# Altium project DS130-1.02 G-M传感器.PrjPcb
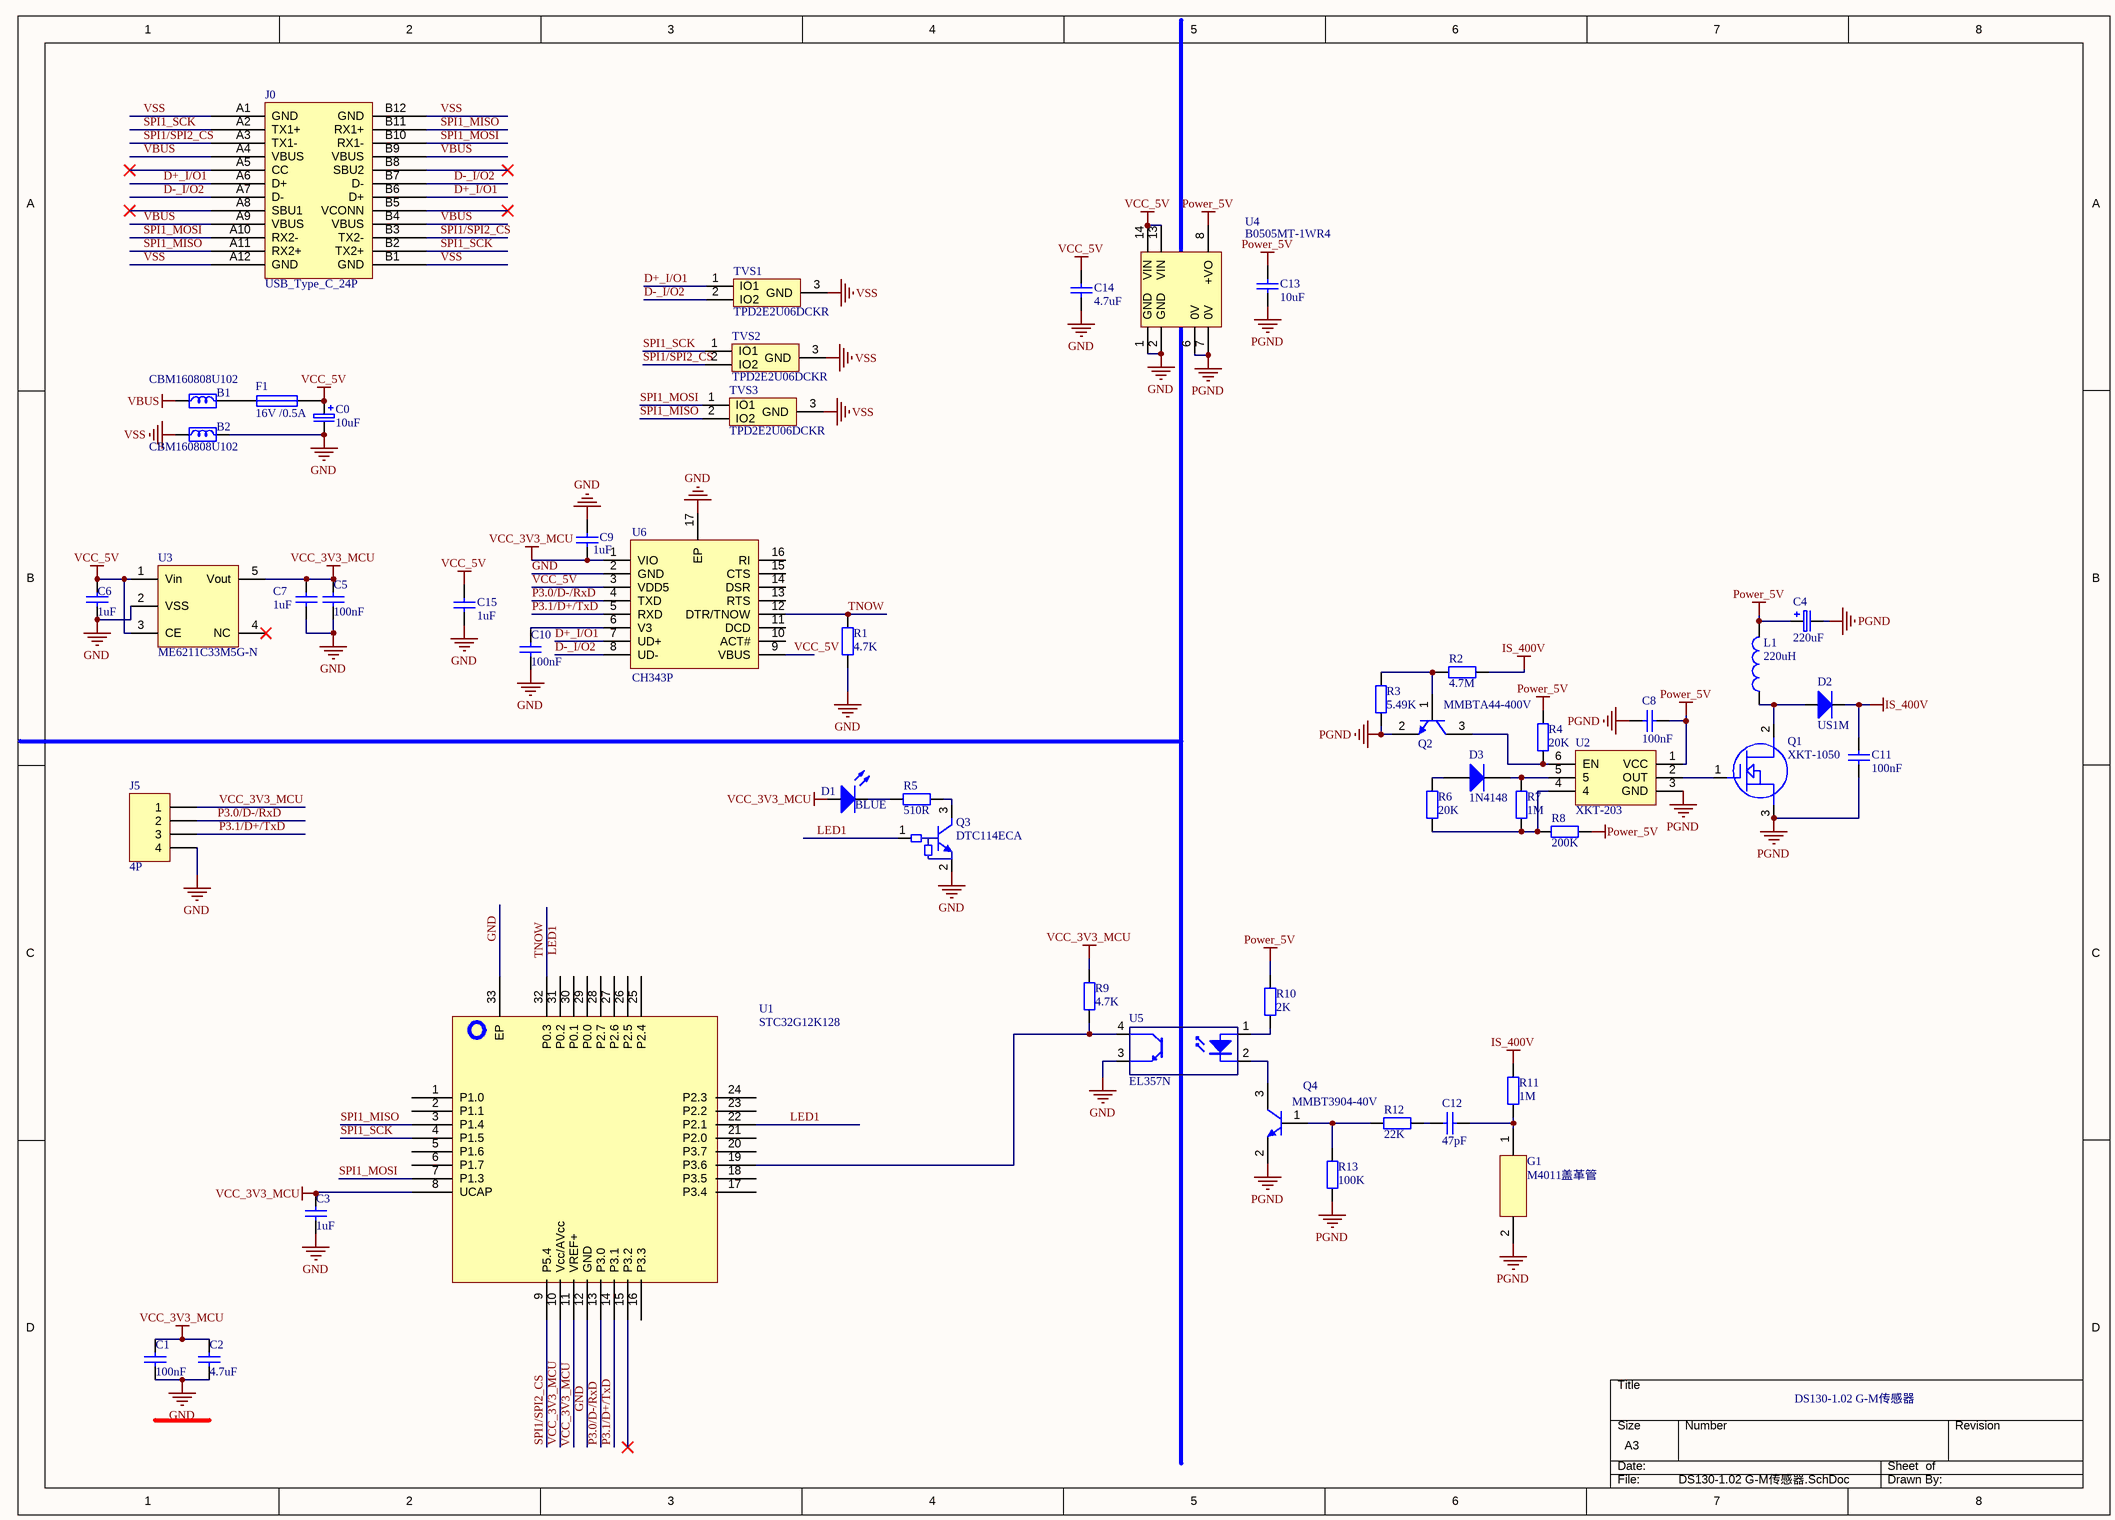
[diagram p0: DS130-1.02 G-M传感器.SchDoc]
1 sheet, 52 parts. Net scope: global (net labels, ports and power ports of the same name join across sheets).
Board file: DS130-1.02 G-M传感器.PcbDoc

## Sheet DS130-1.02 G-M传感器.SchDoc
size A3; SheetNumber: 1; SheetTotal: 1

### Parts
B1  CBM160808U102  [0603Bead]
B2  CBM160808U102  [0603Bead]
C0  value 10uF  [AVX_3216-18(1206)_SMD]  (hidden comment: AVX_10uF/16V ±10％(C106))
C1  value 100nF  [0603CAP]  (hidden comment: SMDCAP00013)
C2  value 4.7uF  [0603CAP]  (hidden comment: SMDCAP00012)
C3  value 1uF  [0603CAP]  (hidden comment: SMDCAP00015)
C4  value 220uF  [AVX_7343-31(2917)_SMD]  (hidden comment: AVX_220uF/16V ±10％(C227))
C5  value 100nF  [0603CAP]  (hidden comment: SMDCAP00013)
C6  value 1uF  [0603CAP]  (hidden comment: SMDCAP00015)
C7  value 1uF  [0603CAP]  (hidden comment: SMDCAP00015)
C8  value 100nF  [0603CAP]  (hidden comment: SMDCAP00013)
C9  value 1uF  [0603CAP]  (hidden comment: SMDCAP00015)
C10  value 100nF  [0603CAP]  (hidden comment: SMDCAP00013)
C11  value 100nF  [DIP_CL_10.16mm]  (hidden comment: DIPCAP03003)
C12  value 47pF  [1206CAP]  (hidden comment: MLCC 47pF 1kV ±5％ 1206)
C13  value 10uF  [0603CAP]  (hidden comment: SMDCAP00016)
C14  value 4.7uF  [0603CAP]  (hidden comment: SMDCAP00012)
C15  value 1uF  [0603CAP]  (hidden comment: SMDCAP00015)
D1  value BLUE  [LED_0805]  (hidden comment: SMDLED00010)
D2  value US1M  [SMA/DO-214AC]  (hidden comment: US1M-DO-214AC)
D3  value 1N4148  [SOD-123]  (hidden comment: DIPDIODE02001)
F1  value 16V /0.5A  [1206FUSE]  (hidden comment: SMD1206-050C-16V)
G1  M4011盖革管  [M4011-90]
J0  USB_Type_C_24P  [USB_TYPE_C_24P_Receptacle]
J5  value 4P  [H4]  (hidden comment: DIP4单排直针  间距2mm 针长11mm 铜)
L1  value 220uH  [IND-SMD_L8.0-W8.0]  (hidden comment: SMD_220uH 8.0*8.0)
Q1  XKT-1050  [TO-252]
Q2  value MMBTA44-400V  [SOT23]  (hidden comment: MMBTA44)
Q3  value DTC114ECA  [SOT23]  (hidden comment: SMDIC000037)
Q4  value MMBT3904-40V  [SOT23]  (hidden comment: MMBT3904)
R1  value 4.7K  [0603RES]  (hidden comment: Chip 4.7K 1/16W ±1％ 0603)
R2  value 4.7M  [1206RES]  (hidden comment: Chip 4.7M 1/4W ±1％ 1206 500V)
R3  value 5.49K  [0603RES]  (hidden comment: Chip 5.49K 1/10W ±1％ 0603)
R4  value 20K  [0603RES]  (hidden comment: SMDRES00058)
R5  value 510R  [0603RES]  (hidden comment: SMDRES00030)
R6  value 20K  [0603RES]  (hidden comment: SMDRES00058)
R7  value 1M  [0603RES]  (hidden comment: SMDRES00085)
R8  value 200K  [0603RES]  (hidden comment: SMDRES00075)
R9  value 4.7K  [0603RES]  (hidden comment: Chip 4.7K 1/16W ±1％ 0603)
R10  value 2K  [0603RES]  (hidden comment: SMDRES00042)
R11  value 1M  [0805RES]  (hidden comment: Chip 1M 1/10W ±1％ 0805 400V)
R12  value 22K  [0603RES]  (hidden comment: SMDRES00108)
R13  value 100K  [0603RES]  (hidden comment: SMDRES00071)
TVS1  TPD2E2U06DCKR  [SC-70-3_L2.0-W1.3-P0.65-LS2.1-BL]
TVS2  TPD2E2U06DCKR  [SC-70-3_L2.0-W1.3-P0.65-LS2.1-BL]
TVS3  TPD2E2U06DCKR  [SC-70-3_L2.0-W1.3-P0.65-LS2.1-BL]
U1  value STC32G12K128  [QFN-32-L4.0-W4.0]  (hidden comment: STC32G12K128_35I QFN32)
U2  XKT-203  [SOT23-6]
U3  ME6211C33M5G-N  [SOT23-5]
U4  B0505MT-1WR4  [DFN-14_7P_L9.0-W7.0-P1.27-BL_B0505MT-1WR4]
U5  EL357N  [SO-4]
U6  CH343P  [QFN-16_L3_W3]

### Nets
GND: B2.2 C0.2 C1.1 C2.1 C3.1 C5.1 C6.1 C7.1 C9.2 C10.1 C14.1 C15.1 J5.4 Q3.2(GND) R1.1 U1.12(GND) U1.33(EP) U3.2(VSS) U4.1(GND) U4.2(GND) U5.3(E) U6.2(GND) U6.17(EP)
IS_400V: C11.1 D2.2(K) R2.2 R11.2
PGND: C4.2 C8.1 C11.2 C13.1 G1.2 Q1.3(S) Q2.2(E) Q4.2(E) R3.1 R13.1 U2.3(GND) U4.6(0V) U4.7(0V)
Power_5V: C4.1 C8.2 C13.2 L1.2 R4.2 R8.1 R10.1 U2.1(VCC) U4.8(+VO)
VBUS: B1.1 J0.A4(VBUS) J0.A9(VBUS) J0.B4(VBUS) J0.B9(VBUS)
VCC_3V3_MCU: C1.2 C2.2 C3.2 C5.2 C7.2 C9.1 D1.1(A) J5.1 R9.2 U1.8(UCAP) U1.10(Vcc/AVcc) U1.11(VREF+) U3.5(Vout) U6.1(VIO)
VCC_5V: C0.1 C6.2 C14.2 C15.2 F1.2 U3.1(Vin) U3.3(CE) U4.13(VIN) U4.14(VIN) U6.3(VDD5) U6.9(VBUS)
VSS: B2.1 J0.A1(GND) J0.A12(GND) J0.B1(GND) J0.B12(GND) TVS1.3(GND) TVS2.3(GND) TVS3.3(GND)
D+_I/O1: J0.A6(D+) J0.B6(D+) TVS1.1(IO1) U6.7(UD+)
D-_I/O2: J0.A7(D-) J0.B7(D-) TVS1.2(IO2) U6.8(UD-)
LED1: Q3.1(IN) U1.22(P2.1)
P3.0/D-/RxD: J5.2 U1.13(P3.0) U6.4(TXD)
P3.1/D+/TxD: J5.3 U1.14(P3.1) U6.5(RXD)
SPI1/SPI2_CS: J0.A3(TX1-) J0.B3(TX2-) TVS2.2(IO2) U1.9(P5.4)
SPI1_MISO: J0.A11(RX2+) J0.B11(RX1+) TVS3.2(IO2) U1.3(P1.4)
SPI1_MOSI: J0.A10(RX2-) J0.B10(RX1-) TVS3.1(IO1) U1.7(P1.3)
SPI1_SCK: J0.A2(TX1+) J0.B2(TX2+) TVS2.1(IO1) U1.4(P1.5)
TNOW: R1.2 U1.32(P0.3) U6.12(DTR/TNOW)
NetB1_2: B1.2 F1.1
NetC10_2: C10.2 U6.6(V3)
NetC12_1: C12.1 G1.1 R11.1
NetC12_2: C12.2 R12.1
NetD1_2: D1.2(K) R5.1
NetD2_1: D2.1(A) L1.1 Q1.2(D)
NetD3_1: D3.1(A) R6.2
NetD3_2: D3.2(K) R7.2 U2.5
NetQ1_1: Q1.1(G) U2.2(OUT)
NetQ2_1: Q2.1(B) R2.1 R3.2
NetQ2_3: Q2.3(C) R4.1 U2.6(EN)
NetQ3_3: Q3.3(OUT) R5.2
NetQ4_1: Q4.1(B) R12.2 R13.2
NetQ4_3: Q4.3(C) U5.2(K)
NetR6_1: R6.1 R7.1 R8.2 U2.4
NetR9_1: R9.1 U1.19(P3.6) U5.4(C)
NetR10_2: R10.2 U5.1(A)

Not connected (* = marked no-connect by the designer): J0 A5(CC)* A8(SBU1)* B5(VCONN)* B8(SBU2)*; U1 1(P1.0) 2(P1.1) 5(P1.6) 6(P1.7) 15(P3.2)* 16(P3.3) 17(P3.4) 18(P3.5) 20(P3.7) 21(P2.0) 23(P2.2) 24(P2.3) 25(P2.4) 26(P2.5) 27(P2.6) 28(P2.7) 29(P0.0) 30(P0.1) 31(P0.2); U3 4(NC)*; U6 10(ACT#) 11(DCD) 13(RTS) 14(DSR) 15(CTS) 16(RI)

### Notes on the sheet
- DS130-1.02 G-M传感器
- Labels drawn without touching a wire or pin: LED1
- DWG. NO.
- REV.
- SHT.
- THIS DOCUMENT AND THE DATA DISCLOSED HEREIN OR HEREWITH IS THE PROPERTY OF ALTIUM LIMITED AND MAY BE FREELY DISTRIBUTED IN WHOLE. NO RIGHTS ARE RESERVED OR EXPRESS OR IMPLIED WARANTEE GIVEN.
- REVISION
- DESCRIPTION
- DATE
- APPROVED
- ENG:
- APPROVALS
- PROJECT
- DSN:
- CHK:
- REFERENCE DOCUMENTS
- PROJECT REVISION:
- TITLE
- DOCUMENT REVISION:
- DESIGN ITEM:
- BOM:
- FAB DWG:
- PCB DWG:
- ASSY DWG:
- SCALE:
- SIZE
- B
- CAGE CODE
- FILE NAME
- DWG NO.
- SHEET
- OF
- REV

### Library data of the parts
B1 B2 = Chip Ferrite Bead 0606: 贴片磁珠
C0 = AVX_10uF/16V ±10％(C106): 钽电容
C1 C5 C8 C10 = MLCC 100nF 50V ±10％ 0603: 贴片电容
C2 C14 = MLCC 4.7uF 50V ±10％ 0603: 贴片电容
C3 C6 C7 C9 C15 = MLCC 1uF 50V ±10％ 0603: 贴片电容
C4 = AVX_220uF/16V ±10％(C227): 钽电容
C11 = CBB22 100nF 630VDC ±5％ DIP2: 插件涤纶电容
C12 = MLCC 47pF 1kV ±5％ 1206: 贴片电容
C13 = MLCC 10uF 50V ±10％ 0603: 贴片电容
D1 = Chip 蓝色LED 0805: 贴片LED
D2 = US1M-DO-214AC: 快恢复/高效率二极管
D3 = 1N4148W: 贴片开关二极管 T4
F1 = SMD1206-050C-16V: 贴片自恢复保险丝 16V /0.5A
J5 = DIP4单排直针  间距2mm 针长11mm 铜: 单排直针
Q1 = XKT-1050: NMOS; Value: XKT-1050
Q2 = MMBTA44: BJT
Q3 = DTC114ECA SOT-23 长电: 数字晶体管
Q4 = MMBT3904: BJT
R1 R9 = Chip 4.7K 1/16W ±1％ 0603: 贴片电阻
R2 = Chip 4.7M 1/4W ±1％ 1206 500V: 贴片电阻
R3 = Chip 5.49K 1/10W ±1％ 0603: 贴片电阻
R4 R6 = Chip 20K 1/16W ±1％ 0603: 贴片电阻
R5 = Chip 510R 1/16W ±1％ 0603: 贴片电阻
R7 = Chip 1M 1/16W ±1％ 0603: 贴片电阻
R8 = Chip 200K 1/16W ±1％ 0603: 贴片电阻
R10 = Chip 2K 1/16W ±1％ 0603: 贴片电阻
R11 = Chip 1M 1/10W ±1％ 0805 400V: 贴片电阻
R12 = Chip 22K 1/16W ±1％ 0603: 贴片电阻
R13 = Chip 100K 1/16W ±1％ 0603: 贴片电阻
U1 = STC32G12K128_35I QFN32: 单片机芯片
U3 = ME6211C33M5G-N: 稳压芯片
U5 = EL357N: 光耦; Value: EL357N
G1 = M4011盖革管: Value: M4011盖革管
TVS1-TVS3 = TPD2E2U06DCKR: Value: TPD2E2U06DCKR
U2 = XKT-203: Value: XKT-203
U4 = B0505MT-1WR4: Value: B0505MT-1WR4
U6 = CH343P: Value: CH343P